# EAGLE design Board_v5 (EAGLE 9.0.0)
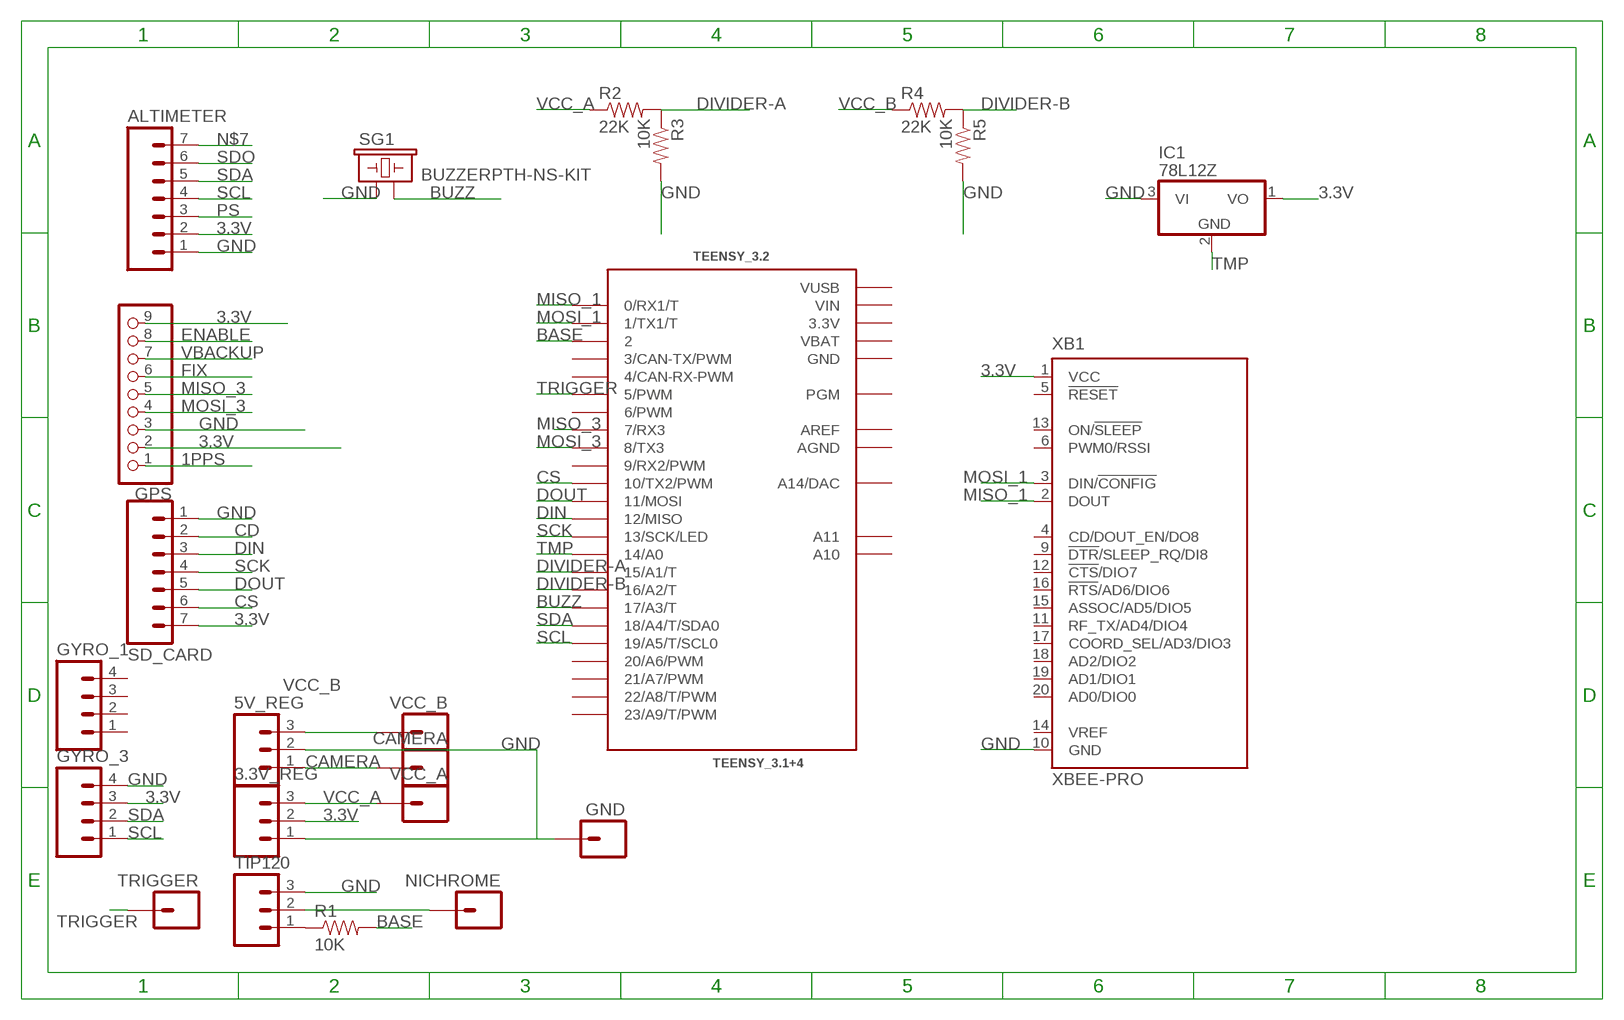
[diagram p0: schematic, sheet 1]

## Parts
3.3V_REG  M03PTH  [1X03]
5V_REG  M03PTH  [1X03]
ALTIMETER  M07  [1X07]
CAMERA  M01NOSILK-KIT  [1X01NS-KIT]
GND  M01PTH_LONGPAD  [1X01_LONGPAD]
GPS  HEADER-1X970MIL  [1X09_ROUND_70]
GYRO_1  M04PTH  [1X04]
GYRO_3  M04PTH  [1X04]
IC1  78L12Z  [TO92]
NICHROME  M01PTH_LONGPAD  [1X01_LONGPAD]
R1  10K  RESISTOREZ  [AXIAL-0.3EZ]
R2  22K  RESISTORAXIAL-0.3  [AXIAL-0.3]
R3  10K  RESISTORAXIAL-0.3  [AXIAL-0.3]
R4  22K  RESISTORAXIAL-0.3  [AXIAL-0.3]
R5  10K  RESISTORAXIAL-0.3  [AXIAL-0.3]
SD_CARD  M07  [1X07]
SG1  BUZZERPTH-NS-KIT  [BUZZER-12MM-NS-KIT]
TEENSY_3.2  TEENSY_3.1+4  [TEENSY_3.1+4]
TIP120  M03PTH  [1X03]
TRIGGER  M01NOSILK-KIT  [1X01NS-KIT]
VCC_A  M01PTH_LONGPAD  [1X01_LONGPAD]
VCC_B  M01OFFSET  [1X01_OFFSET]
XB1  XBEE-PRO  [XBEE-PRO]

## Nets
1PPS: GPS.1
3.3V: 3.3V_REG.2 ALTIMETER.2 GPS.2 GPS.9 GYRO_3.3 IC1.1(VO) SD_CARD.7 XB1.1(VCC)
BASE: R1.P$2 TEENSY_3.2.2
BUZZ: SG1.- TEENSY_3.2.17/A3(17/A3/T)
CAMERA: 5V_REG.1 CAMERA.1
CD: SD_CARD.2
CS: SD_CARD.6 TEENSY_3.2.10(10/TX2/PWM)
DIN: SD_CARD.3 TEENSY_3.2.12(12/MISO)
DIVIDER-A: R2.P$2 R3.P$1 TEENSY_3.2.15/A1(15/A1/T)
DIVIDER-B: R4.P$2 R5.P$1 TEENSY_3.2.16/A2(16/A2/T)
DOUT: SD_CARD.5 TEENSY_3.2.11(11/MOSI)
ENABLE: GPS.8
FIX: GPS.6
GND: 3.3V_REG.1 5V_REG.2 ALTIMETER.1 GND.1 GPS.3 GYRO_3.4 IC1.3(VI) R3.P$2 R5.P$2 SD_CARD.1 SG1.+ TIP120.3 XB1.10(GND)
MISO_1: TEENSY_3.2.0(0/RX1/T) XB1.2(DOUT)
MISO_3: GPS.5 TEENSY_3.2.7(7/RX3)
MOSI_1: TEENSY_3.2.1(1/TX1/T) XB1.3(DIN/!CONFIG)
MOSI_3: GPS.4 TEENSY_3.2.8(8/TX3)
N$1: R1.P$1 TIP120.1
N$7: ALTIMETER.7
NICHROME: NICHROME.1 TIP120.2
PS: ALTIMETER.3
SCK: SD_CARD.4 TEENSY_3.2.13(13/SCK/LED)
SCL: ALTIMETER.4 GYRO_3.1 TEENSY_3.2.19/A5(19/A5/T/SCL0)
SDA: ALTIMETER.5 GYRO_3.2 TEENSY_3.2.18/A4(18/A4/T/SDA0)
SDO: ALTIMETER.6
TMP: IC1.2(GND) TEENSY_3.2.14/A0
TRIGGER: TEENSY_3.2.5(5/PWM) TRIGGER.1
VBACKUP: GPS.7
VCC_A: 3.3V_REG.3 R2.P$1 VCC_A.1
VCC_B: 5V_REG.3 R4.P$1 VCC_B.1
Unconnected: GYRO_1.1 GYRO_1.2 GYRO_1.3 GYRO_1.4 TEENSY_3.2.3(3/CAN-TX/PWM) TEENSY_3.2.4(4/CAN-RX-PWM) TEENSY_3.2.6(6/PWM) TEENSY_3.2.9(9/RX2/PWM) TEENSY_3.2.20/A6(20/A6/PWM) TEENSY_3.2.21/A7(21/A7/PWM) TEENSY_3.2.22/A8(22/A8/T/PWM) TEENSY_3.2.23/A9(23/A9/T/PWM) TEENSY_3.2.A10 TEENSY_3.2.A11 TEENSY_3.2.A14(A14/DAC) TEENSY_3.2.PGM XB1.4(CD/DOUT_EN/DO8) XB1.5(!RESET) XB1.6(PWM0/RSSI) XB1.9(!DTR!/SLEEP_RQ/DI8) XB1.11(RF_TX/AD4/DIO4) XB1.12(!CTS!/DIO7) XB1.13(ON/!SLEEP) XB1.14(VREF) XB1.15(ASSOC/AD5/DIO5) XB1.16(!RTS!/AD6/DIO6) XB1.17(COORD_SEL/AD3/DIO3) XB1.18(AD2/DIO2) XB1.19(AD1/DIO1) XB1.20(AD0/DIO0)

## Power pins joined to a net without a drawn wire
3.3V: TEENSY_3.2.3.3V TEENSY_3.2.3.3V1(3.3V)
AGND: TEENSY_3.2.AGND
AREF: TEENSY_3.2.AREF
GND: TEENSY_3.2.GND TEENSY_3.2.GND1(GND)
VBAT: TEENSY_3.2.VBAT
VIN: TEENSY_3.2.VIN
VUSB: TEENSY_3.2.VUSB

## Library data of the parts
3.3V_REG 5V_REG TIP120 = SparkFun-Connectors:M03: Header 3 Standard 3-pin 0.1" header. Use with straight break away headers (SKU : PRT-00116), right angle break away headers (PRT-00553), swiss pins (PRT-00743), machine pins (PRT-00117), and female headers (PRT-00115). Molex polarized connector foot print use with SKU : PRT-08232 with associated crimp pins and housings.
ALTIMETER SD_CARD = SparkFun-Connectors:M07: Header 7 Standard 7-pin 0.1" header. Use with straight break away headers (SKU : PRT-00116), right angle break away headers (PRT-00553), swiss pins (PRT-00743), machine pins (PRT-00117), and female headers (PRT-00115). NOTES ON THE VARIANTS LOCK and LOCK_LONGPADS... This footprint was designed to help hold the alignment of a through-hole component (i.e. 7-pin header) while soldering it into place. You may notice that each hole has been shifted either up or down by 0.005 of an inch from it's more standard position (which is usually a perfectly straight line). This slight alteration caused the pins (the squares in the middle) to touch the edges of the holes. Because they are alternating, it causes a "brace" to hold the header in place. 0.005 has proven to be the perfect amount of "off-center" position when using our standard breakaway headers. Although looks a little odd when you look at the bare footprint, once you have a header in there, the alteration is very hard to notice. Also, if you push a header all the way into place, it is covered up entirely on the bottom side. This idea of altering the position of holes to aid alignment will be further integrated into the Sparkfun Library for other footprints. It can help hold any component with 3 or more connection pins.
CAMERA GND NICHROME TRIGGER VCC_A VCC_B = SparkFun-Connectors:M01: Header 1 Standard 1-pin 0.1" header. Use with straight break away headers (SKU : PRT-00116), right angle break away headers (PRT-00553), swiss pins (PRT-00743), machine pins (PRT-00117), and female headers (PRT-00115). SMTSO-256-ET is a "flush mount" nut for a 4-40 screw. The older package used to be too tight, and did not allow it to sit properly thru the drill hit. The latest (0.165DIA) fits nice and snug.
GPS = microbuilder:HEADER-1X9: PIN HEADER
GYRO_1 GYRO_3 = SparkFun-Connectors:M04: Header 4 Standard 4-pin 0.1" header. Use with straight break away headers (SKU : PRT-00116), right angle break away headers (PRT-00553), swiss pins (PRT-00743), machine pins (PRT-00117), and female headers (PRT-00115). Molex polarized connector foot print use with SKU : PRT-08231 with associated crimp pins and housings. 1MM SMD Version SKU: PRT-10208; PROD_ID: CONN-09696
IC1 = adafruit:78*: Positive VOLTAGE REGULATOR Added bigger pads to the TO-92 package
R1 = SparkFun-Passives:RESISTOR: Resistor Basic schematic elements and footprints for 0603, 1206, and PTH resistors.
R2-R5 = SparkFun-Resistors:RESISTOR: Resistor Basic schematic elements and footprints for 0603, 1206, and PTH resistors.
SG1 = SparkFun:BUZZER: Buzzer 12mm Spark Fun Electronics SKU : Comp-Buzzer
TEENSY_3.2 = Teensy_3_Series_Board_v1.0:TEENSY_3.1+4: Footprint for Teensy 3.1 board using all through-holes, i.e. the entire perimeter plus the 4 through-holes inboard (A10,A11,AREF, VUSB)
XB1 = maxstream:XBEE: XBee (TM) /XBee-PRO(TM) OEM RF Modules Source: MaxStream, Inc. xbee_productmanual.pdf; MPN: XBP24-AWI-001; OC_FARNELL: 1337916; OC_NEWARK: 42M2667

## Net classes
0 default: clearance 0.205 mm

## Board
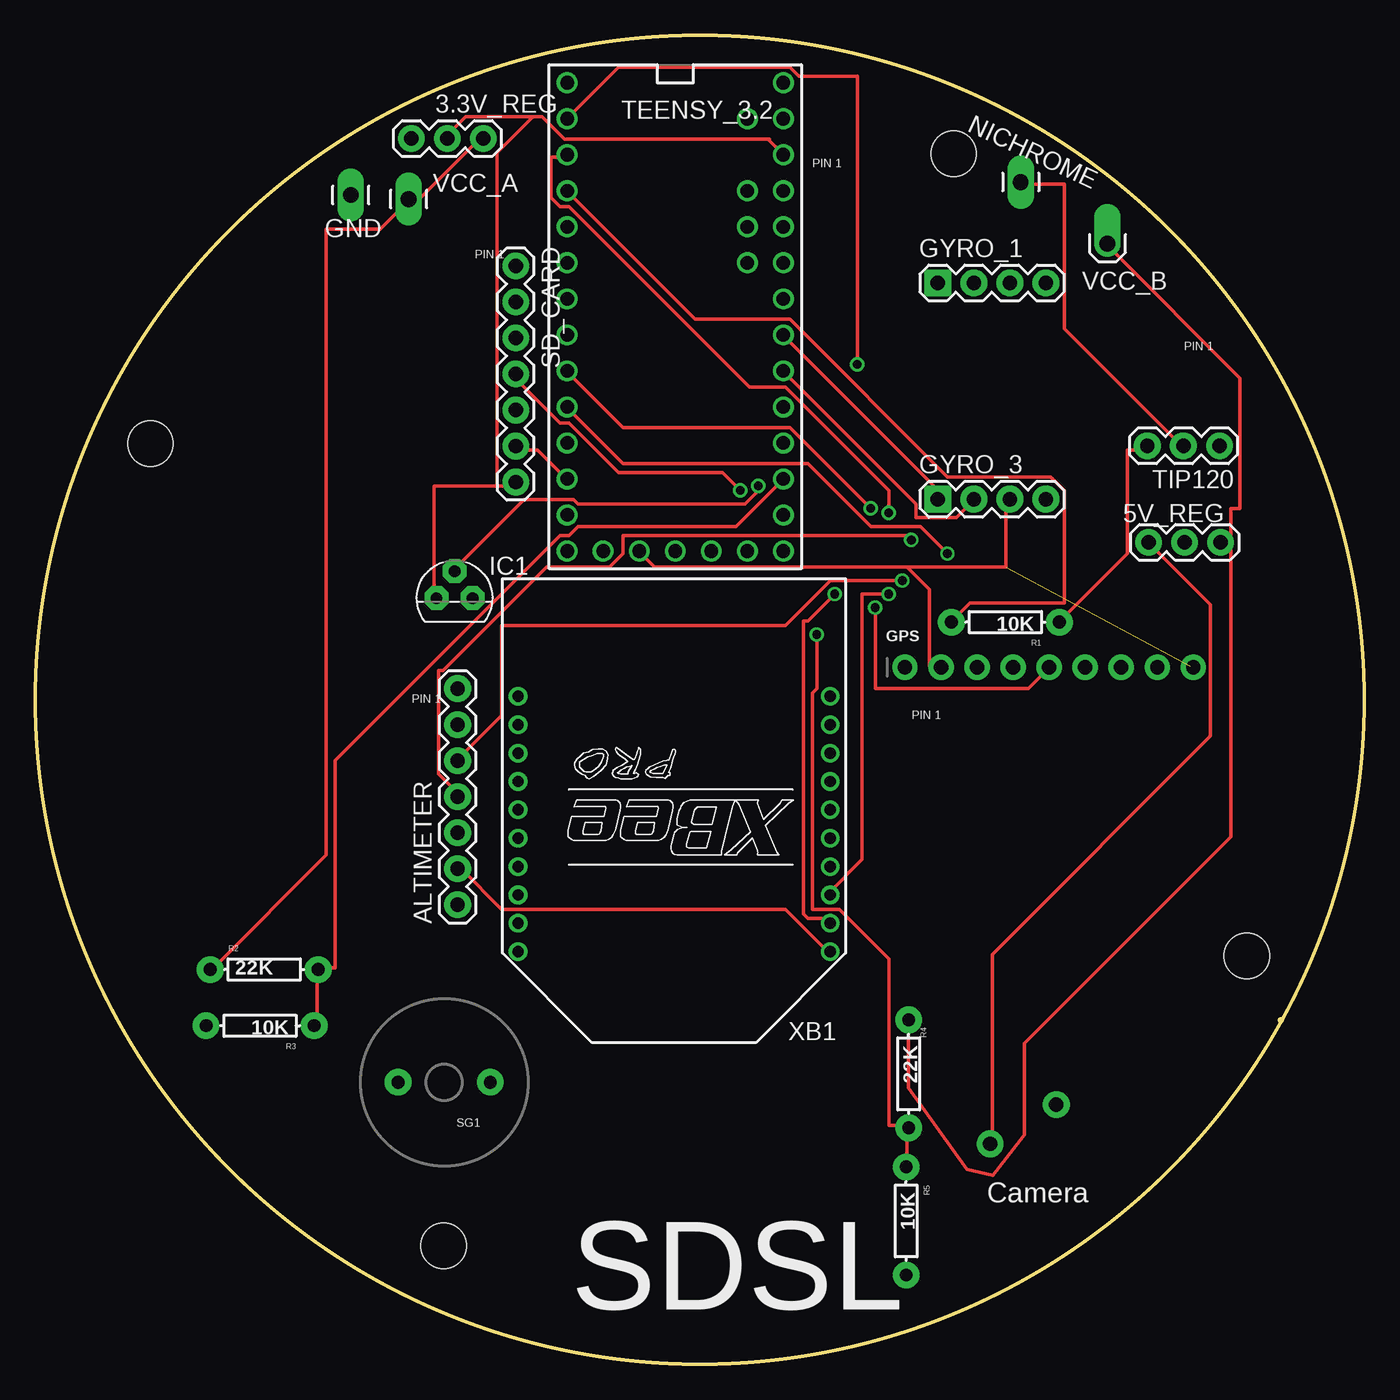
[diagram p1: board, top side]
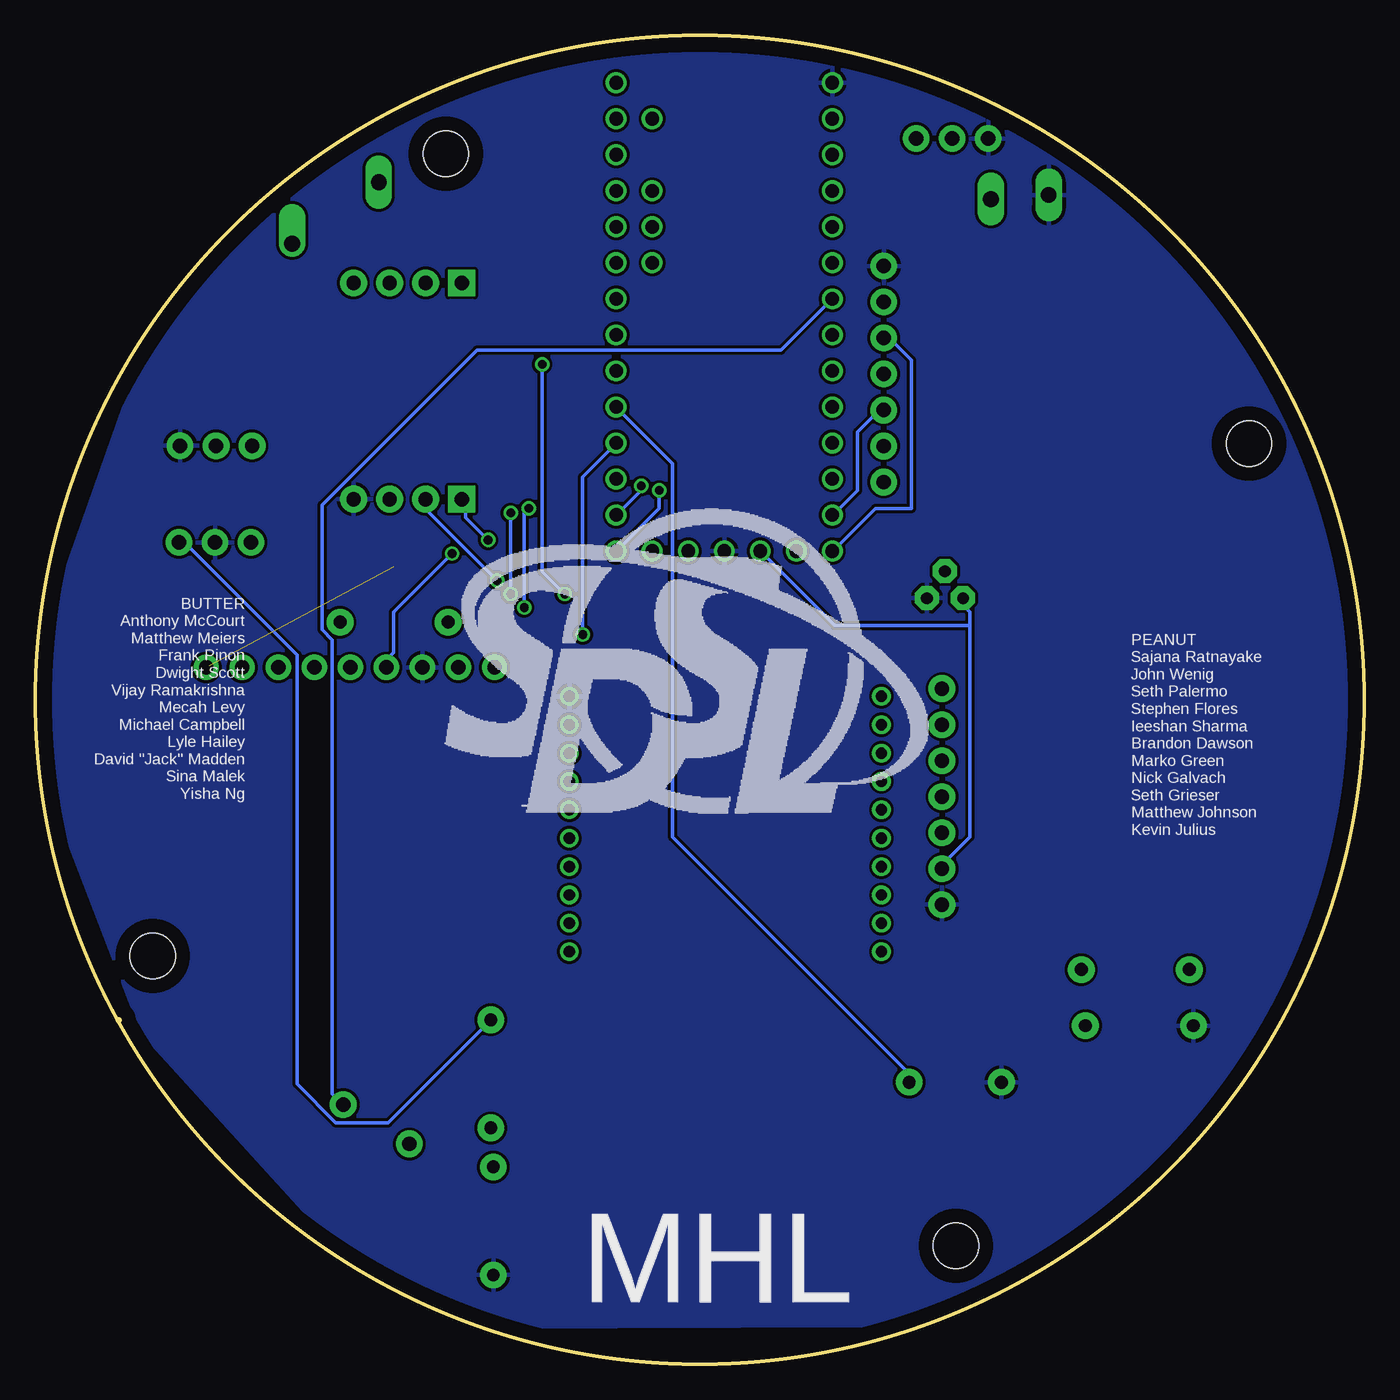
[diagram p2: board, bottom side, seen from below]

Size 93.69 x 93.69 mm. Coordinates in mm from the lower left corner, seen from the top.
Outline: 87.82,24.26 87.81,24.24
Outline: circle at 46.84,46.84 radius 46.84
Copper layers (1*16): Top 0.035mm / dielectric 1.5mm / Bottom 0.035mm
Design rules "default": minimum track width 10mil, minimum drill 24mil, track to track 8mil, track to pad 8mil, pad to pad 8mil, via to via 8mil, smd to smd 8mil, copper to edge 40mil, drill to drill 8mil, minimum pad ring 10mil, minimum via ring 8mil, stop-mask expansion 4mil, vias tented up to drill 0mil, thermal gap 10mil
Holes 3.2 mm at 64.75,85.35 85.43,28.78 8.11,64.9 28.78,8.34

### Footprints (pad centres in the part's own frame; a part is rotated, then mirrored left to right if it is on the bottom)
1X03 = drill 1.016 pad 1.88: 1 0,0; 2 2.54,0; 3 5.08,0
1X07 = drill 1.016 pad 1.88: 1 0,0; 2 2.54,0; 3 5.08,0; 4 7.62,0; 5 10.16,0; 6 12.7,0; 7 15.24,0
1X01NS-KIT = drill 1.016 pad 1.88: 1 0,0
1X01_LONGPAD = drill 1.118 pad 1.88 long: 1 0,0
1X09_ROUND_70 = drill 1 pad 1.778: 1 -10.16,0; 2 -7.62,0; 3 -5.08,0; 4 -2.54,0; 5 0,0; 6 2.54,0; 7 5.08,0; 8 7.62,0; 9 10.16,0
1X04 = drill 1.016 pad 1.88 square: 1 0,0 | drill 1.016 pad 1.88: 2 2.54,0; 3 5.08,0; 4 7.62,0
TO92 = drill 0.813 pad 1.676 octagon: 1 -1.27,0; 2 0,1.905; 3 1.27,0
AXIAL-0.3EZ = drill 0.9 pad 1.88: P$1 -3.81,0; P$2 3.81,0
AXIAL-0.3 = drill 0.9 pad 1.88: P$1 -3.81,0; P$2 3.81,0
BUZZER-12MM-NS-KIT = drill 0.9 pad 1.88: + 3.25,0; - -3.25,0
TEENSY_3.1+4 = drill 0.965: 0 -7.62,15.24; 1 -7.62,12.7; 2 -7.62,10.16; 3 -7.62,7.62; 3.3V 7.62,12.7; 3.3V1 -2.54,-15.24; 4 -7.62,5.08; 5 -7.62,2.54; 6 -7.62,0; 7 -7.62,-2.54; 8 -7.62,-5.08; 9 -7.62,-7.62; 10 -7.62,-10.16; 11 -7.62,-12.7; 12 -7.62,-15.24; 13 7.62,-15.24; 14/A0 7.62,-12.7; 15/A1 7.62,-10.16; 16/A2 7.62,-7.62; 17/A3 7.62,-5.08; 18/A4 7.62,-2.54; 19/A5 7.62,0; 20/A6 7.62,2.54; 21/A7 7.62,5.08; 22/A8 7.62,7.62; 23/A9 7.62,10.16; A10 5.08,7.62; A11 5.08,5.08; A14 5.08,-15.24; AGND 7.62,15.24; AREF 5.08,10.16; GND -7.62,17.78; GND1 0,-15.24; PGM 2.54,-15.24; VBAT -5.08,-15.24; VIN 7.62,17.78; VUSB 5.08,15.24
1X01_OFFSET = drill 1.118 pad 1.88 offset: 1 0,0
XBEE-PRO = drill 0.8 pad 1.27: 1 -11,9; 2 -11,7; 3 -11,5; 4 -11,3; 5 -11,1; 6 -11,-1; 7 -11,-3; 8 -11,-5; 9 -11,-7; 10 -11,-9; 11 11,-9; 12 11,-7; 13 11,-5; 14 11,-3; 15 11,-1; 16 11,1; 17 11,3; 18 11,5; 19 11,7; 20 11,9

### Placement (x,y rotation side)
3.3V_REG  26.5,86.42 0 top
5V_REG  78.49,57.94 0 top
ALTIMETER  29.77,32.39 90 top
CAMERA  67.32,15.53 0 top
GND  22.24,82.44 180 top
GPS  71.48,49.13 0 top
GYRO_1  63.63,76.23 0 top
GYRO_3  63.63,60.99 0 top
IC1  29.55,54.01 0 top
NICHROME  69.48,83.34 0 top
R1  68.4,52.32 180 top
R2  16.13,27.82 0 top
R3  15.84,23.86 180 top
R4  61.58,20.46 270 top
R5  61.4,10.09 270 top
SD_CARD  33.86,77.43 270 top
SG1  28.83,19.87 180 top
TEENSY_3.2  45.12,72.57 0 top
TIP120  78.41,64.75 0 top
TRIGGER  71.99,18.3 0 top
VCC_A  26.32,82.15 180 top
VCC_B  75.6,79.01 0 top
XB1  45.03,38.08 180 top

### Tracks (layer width: path | path; a pad name or v marks a point on that pad's centre or on a via)
3.3V  (1 unrouted)
  Top 0.254: 61.45,56.2 43.67,56.2 42.72,57.16 TEENSY_3.2.3.3V1 | 61.45,56.2 63.04,54.62 63.04,49.22 63.67,49.22 GPS.2 | 81.45,49.22 GPS.9 | 61.45,56.2 68.43,56.2 68.43,60.97 GYRO_3.3 | XB1.1 55.73,29.22 52.88,32.07 32.87,32.07 30.02,34.93 ALTIMETER.2 29.7,34.93 | 32.56,61.92 33.83,61.92 SD_CARD.7 | 32.56,61.92 28.11,61.92 28.11,54.3 IC1.1 | 35.1,87.95 35.73,87.95 37.32,86.37 51.75,86.37 51.75,86.26 TEENSY_3.2.3.3V | 35.1,87.95 30.33,87.95 29.06,86.68 3.3V_REG.2 | 32.56,61.92 32.56,85.41 35.1,87.95
  Bottom 0.254: 27.79,52.08 27.79,53.03 28.11,53.35 28.11,53.98 IC1.1 | 27.79,52.08 27.79,37.15 29.7,35.25 ALTIMETER.2 | TEENSY_3.2.3.3V1 37.32,52.08 27.79,52.08
BASE
  Top 0.254: TEENSY_3.2.2 37.64,82.56 46.53,73.67 53.19,73.67 64.31,62.55 71.61,62.55 72.56,61.6 72.56,53.66 65.89,53.66 64.62,52.39 R1.P$2
BUZZ
  Bottom 0.254: TEENSY_3.2.17/A3 48.75,63.51 48.75,37.15 32.24,20.64 32.24,20.01 SG1.-
CAMERA
  Top 0.254: CAMERA.1 67.48,15.56 67.48,28.89 82.86,44.27 82.86,53.57 5V_REG.1
CS
  Top 0.254: TEENSY_3.2.10 37.32,62.55 35.41,64.46 34.14,64.46 SD_CARD.6
DIN
  Bottom 0.254: TEENSY_3.2.12 37.32,57.47 34.46,60.33 31.92,60.33 31.92,70.81 33.19,72.08 33.83,72.08 SD_CARD.3
DIVIDER-A
  Top 0.254: TEENSY_3.2.15/A1 49.38,59.06 38.27,59.06 37.64,58.43 37,58.43 21.13,42.55 21.13,27.95 20.17,27.95 R2.P$2 19.86,27.63 19.86,24.14 R3.P$1
DIVIDER-B  (via drill 0.61)
  Top 0.254: v55.1,51.44 55.1,47.63 54.78,47.31 54.78,32.07 56.69,32.07 60.18,28.58 60.18,16.83 61.45,16.83 R4.P$2 61.45,16.52 61.45,13.98 R5.P$1
  Bottom 0.254: v55.1,51.44 55.1,62.55 52.88,64.78 TEENSY_3.2.16/A2
DOUT
  Bottom 0.254: TEENSY_3.2.11 37.32,60.01 35.73,61.6 35.73,65.73 34.14,67.32 SD_CARD.5
GND
  pour Bottom: 21.24,8.4 26.41,5.32 35.27,2.74 61.4,2.62 63.31,3.36 70.49,6.15 86.14,23.36 91.94,38.48 93.54,43.44 92.5,53.1 86.66,69.65 82.99,75.53 79.18,80.47 77.12,82.53 77.02,82.53 76.21,83.34 76.05,83.34 75.77,83.62 75.65,83.62 75.01,84.26 74.81,84.26 74.23,84.84 74,84.84 73.51,85.33 73.36,85.33 72.93,85.76 72.65,85.76 72.32,86.09 72.07,86.09 71.84,86.32 68.48,87.92 63.18,90.43 54.36,92.64 37.45,92.64 37.01,92.21 35.57,92.21 34.8,91.45 32.06,91.45 31.3,90.68 30.28,90.68 28.99,89.39 27.57,89.39 27.03,88.86 26.3,88.86 25.74,88.3 25.18,88.3 24.54,87.66 24.06,87.66 23.25,86.85 22.41,86.85 21.75,86.19 21.57,86.19 21.14,85.76 20.73,85.76 20.38,85.4 20.38,85.22 20.33,85.17 20.17,85.17 19.97,84.97 19.74,84.97 19.26,84.49 19.26,83.83 18.07,82.63 15.61,80.42 12.61,77.13 10.39,75.29 7.98,71.36 5.43,67.27 3.14,62.36 0.8,49.19 1.14,39.07 2.24,35.94 2.75,33.53 3.28,31.14 4.3,29.01 10.37,18.03 11.08,17.19 19.26,9.91
MISO_1  (via drill 0.61)
  Top 0.254: v56.37,54.3 54.46,52.39 54.15,52.39 54.15,31.76 54.46,31.44 55.42,31.44 55.73,31.12 XB1.2 | v57.96,70.49 57.96,90.81 53.83,90.81 53.19,91.45 41.13,91.45 TEENSY_3.2.0
  Bottom 0.254: v56.37,54.3 57.96,55.89 v57.96,70.49
MISO_3  (via drill 0.61)
  Top 0.254: v58.91,60.33 53.19,66.05 41.45,66.05 37.64,69.86 TEENSY_3.2.7 | v59.23,53.35 59.23,47.63 70.02,47.63 71.29,48.9 GPS.5
  Bottom 0.254: v58.91,60.33 59.23,60.01 v59.23,53.35
MOSI_1  (via drill 0.61)
  Top 0.254: v60.18,54.3 58.27,54.3 58.27,35.57 56.05,33.34 XB1.3 | v60.18,60.01 60.18,61.6 52.88,68.9 50.34,68.9 37.64,81.6 37,81.6 36.37,82.24 36.37,85.1 37.32,85.1 TEENSY_3.2.1
  Bottom 0.254: v60.18,60.01 v60.18,54.3
MOSI_3  (via drill 0.61)
  Top 0.254: v64.31,57.16 62.4,59.06 58.91,59.06 54.46,63.51 41.45,63.51 37.64,67.32 TEENSY_3.2.8
  Bottom 0.254: v64.31,57.16 68.43,53.03 68.43,50.17 68.75,49.85 68.75,49.22 GPS.4
N$1
  Top 0.254: R1.P$1 72.24,52.39 77.01,57.16 77.01,64.46 78.28,64.46 TIP120.1
NICHROME
  Top 0.254: TIP120.2 80.82,64.78 72.56,73.03 72.56,83.19 69.7,83.19 NICHROME.1
SCK  (via drill 0.61)
  Top 0.254: v49.7,61.6 48.43,62.87 41.13,62.87 37.64,66.36 37,66.36 33.83,69.54 SD_CARD.4
  Bottom 0.254: v49.7,61.6 49.7,60.33 52.56,57.47 TEENSY_3.2.13
SCL  (via drill 0.61)
  Top 0.254: TEENSY_3.2.19/A5 52.88,72.4 63.35,61.92 63.35,61.28 GYRO_3.1 | v61.77,58.11 61.45,58.43 41.45,58.43 41.45,57.16 40.49,56.2 36.05,56.2 28.75,48.9 28.43,48.9 28.43,41.6 29.7,40.33 ALTIMETER.4
  Bottom 0.254: v61.77,58.11 63.35,59.7 63.35,60.97 GYRO_3.1
SDA  (via drill 0.61)
  Top 0.254: TEENSY_3.2.18/A4 52.88,69.86 62.08,60.65 62.08,59.7 64.94,59.7 66.21,60.97 GYRO_3.2 | v61.13,55.25 56.05,55.25 52.88,52.08 32.87,52.08 32.87,45.73 30.02,42.87 ALTIMETER.5
  Bottom 0.254: v61.13,55.25 66.21,60.33 66.21,60.97 GYRO_3.2
TMP  (via drill 0.61)
  Top 0.254: v50.97,61.92 50.97,61.6 50.02,60.65 38.27,60.65 37.95,60.97 34.46,60.97 29.7,56.2 IC1.2
  Bottom 0.254: v50.97,61.92 50.97,61.6 52.56,60.01 TEENSY_3.2.14/A0
TRIGGER
  Bottom 0.254: TRIGGER.1 72.75,19.06 72.75,51.06 73.48,51.79 73.48,60.57 62.55,71.49 41.12,71.49 TEENSY_3.2.5
VCC_A
  Top 0.254: R2.P$1 12.55,27.95 20.49,35.88 20.49,80.02 24.3,80.02 26.21,81.92 VCC_A.1 26.52,82.24 27.16,82.24 31.29,86.37 3.3V_REG.3
VCC_B
  Top 0.254: VCC_B.1 75.74,78.75 84.94,69.54 84.94,60.33 84.31,60.33 84.31,37.17 69.74,22.61 69.74,16.15 67.51,13.32 65.69,13.75 61.58,19.47 R4.P$1
  Bottom 0.254: 5V_REG.3 83.36,58.11 75.24,50 75.24,19.75 72.51,17.03 68.82,17.03 R4.P$1

### Text on the board
_tsilk: PIN 1 | PIN 1 | PIN 1 | PIN 1 | PIN 1 | Camera | SDSL
_bsilk: BUTTER / Anthony McCourt / Matthew Meiers / Frank Pinon / Dwight Scott / Vijay Ramakrishna / Mecah Levy / Michael Campbell / Lyle Hailey / David "Jack" Madden / Sina Malek / Yisha Ng | PEANUT / Sajana Ratnayake / John Wenig / Seth Palermo / Stephen Flores / Ieeshan Sharma / Brandon Dawson / Marko Green / Nick Galvach / Seth Grieser / Matthew Johnson / Kevin Julius | MHL